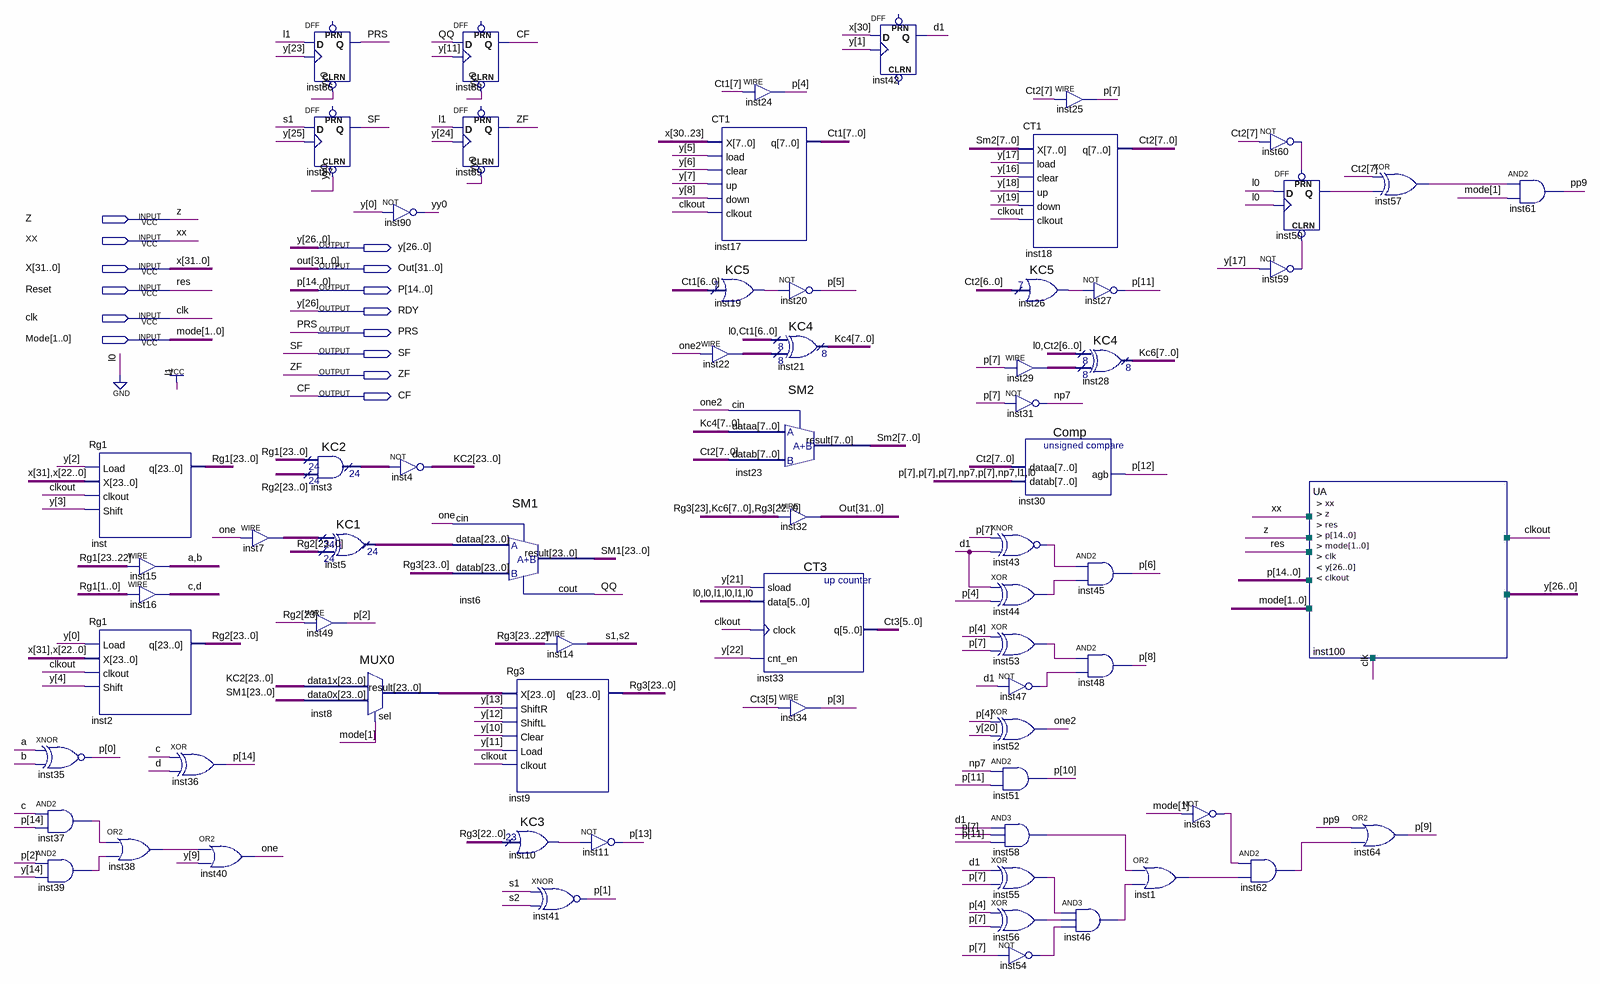
[diagram p0: schematic sheet]
// Quartus schematic lab.bdf as structural Verilog: 69 symbols, 14 pins
module lab (
  input  Z,
  input  XX,
  input  [31:0] X,
  input  Reset,
  input  clk,
  input  [1:0] Mode,
  output [26:0] y,
  output [31:0] Out,
  output [14:0] P,
  output RDY,
  output PRS,
  output SF,
  output ZF,
  output CF
);

  wire a, b, c, clkout, d, d1, inst1_out, inst10_result, inst19_result, inst26_result, inst37_out,
       inst38_out, inst39_out, inst43_out, inst44_out, inst46_out, inst47_out, inst50_q, inst53_out,
       inst54_out, inst55_out, inst56_out, inst57_out, inst58_out, inst59_out, inst60_out, inst62_out,
       inst63_out, np7, one, one2, pp9, QQ, s1, s2, yy0;
  wire [5:0] Ct3;
  wire [7:0] Ct1, Ct2, inst22_out, inst29_out, Kc4, Kc6, Sm2;
  wire [23:0] inst3_result, inst5_result, inst7_out, inst8_result, KC2, Rg1, Rg2, Rg3, SM1;

  xnor inst35 (P[0], a, b);
  and inst37 (inst37_out, c, P[14]);
  and inst39 (inst39_out, P[2], y[14]);
  Rg1 inst (.Load(y[2]), .X({X[31], X[22:0]}), .clkout(clkout), .Shift(y[3]), .q(Rg1));
  assign {a, b} = Rg1[23:22];  // WIRE inst15
  assign {c, d} = Rg1[1:0];  // WIRE inst16
  Rg1 inst2 (.Load(y[0]), .X({X[31], X[22:0]}), .clkout(clkout), .Shift(y[4]), .q(Rg2));
  or inst38 (inst38_out, inst37_out, inst39_out);
  xor inst36 (P[14], c, d);
  assign inst7_out = {24{one}};  // WIRE inst7
  or inst40 (one, inst38_out, y[9]);
  DFF inst86 (.CLRN(yy0), .CLK(y[23]), .D(1'b1), .Q(PRS));  // open: PRN
  DFF inst87 (.CLRN(yy0), .CLK(y[25]), .D(s1), .Q(SF));  // open: PRN
  KC2 inst3 (.data0x(Rg1), .data1x(Rg2), .result(inst3_result));
  KC1 inst5 (.data0x(inst7_out), .data1x(Rg2), .result(inst5_result));
  assign P[2] = Rg2[23];  // WIRE inst49
  MUX0 inst8 (.data1x(KC2), .data0x(SM1), .sel(Mode[1]), .result(inst8_result));
  not inst90 (yy0, y[0]);
  assign KC2 = ~inst3_result;  // NOT inst4, 24 bits wide
  DFF inst88 (.CLRN(yy0), .CLK(y[11]), .D(QQ), .Q(CF));  // open: PRN
  DFF inst89 (.CLRN(yy0), .CLK(y[24]), .D(1'b1), .Q(ZF));  // open: PRN
  SM1 inst6 (.dataa(inst5_result), .datab(Rg3), .cin(one), .result(SM1), .cout(QQ));
  Rg3 inst9 (.X(inst8_result), .ShiftR(y[13]), .ShiftL(y[12]), .Clear(y[10]), .Load(y[11]), .clkout(clkout), .q(Rg3));
  KC3 inst10 (.data(Rg3[22:0]), .result(inst10_result));
  assign {s1, s2} = Rg3[23:22];  // WIRE inst14
  not inst11 (P[13], inst10_result);
  xnor inst41 (P[1], s1, s2);
  assign P[4] = Ct1[7];  // WIRE inst24
  CT1 inst17 (.X(X[30:23]), .load(y[5]), .clear(y[6]), .up(y[7]), .down(y[8]), .clkout(clkout), .q(Ct1));
  KC5 inst19 (.data(Ct1[6:0]), .result(inst19_result));
  assign inst22_out = {8{one2}};  // WIRE inst22
  SM2 inst23 (.dataa(Kc4), .datab(Ct2), .cin(one2), .result(Sm2));
  CT3 inst33 (.sload(y[21]), .data(6'b001010), .clock(clkout), .cnt_en(y[22]), .q(Ct3));
  not inst20 (P[5], inst19_result);
  KC4 inst21 (.data0x({1'b0, Ct1[6:0]}), .data1x(inst22_out), .result(Kc4));
  assign Out = {Rg3[23], Kc6, Rg3[22:0]};  // WIRE inst32
  assign P[3] = Ct3[5];  // WIRE inst34
  DFF inst42 (.CLK(y[1]), .D(X[30]), .Q(d1));  // open: CLRN, PRN
  CT1 inst18 (.X(Sm2), .load(y[17]), .clear(y[16]), .up(y[18]), .down(y[19]), .clkout(clkout), .q(Ct2));
  KC5 inst26 (.data(Ct2[6:0]), .result(inst26_result));
  assign inst29_out = {8{P[7]}};  // WIRE inst29
  not inst31 (np7, P[7]);
  Comp inst30 (.dataa(Ct2), .datab({{3{P[7]}}, np7, P[7], np7, 2'b10}), .agb(P[12]));
  xnor inst43 (inst43_out, P[7], d1);
  xor inst44 (inst44_out, d1, P[4]);
  xor inst53 (inst53_out, P[4], P[7]);
  not inst47 (inst47_out, d1);
  xor inst52 (one2, P[4], y[20]);
  and inst51 (P[10], np7, P[11]);
  and inst58 (inst58_out, d1, P[7], P[11]);
  xor inst55 (inst55_out, d1, P[7]);
  xor inst56 (inst56_out, P[4], P[7]);
  not inst54 (inst54_out, P[7]);
  assign P[7] = Ct2[7];  // WIRE inst25
  not inst27 (P[11], inst26_result);
  KC4 inst28 (.data0x({1'b0, Ct2[6:0]}), .data1x(inst29_out), .result(Kc6));
  and inst45 (P[6], inst43_out, inst44_out);
  and inst48 (P[8], inst53_out, inst47_out);
  and inst46 (inst46_out, inst55_out, inst56_out, inst54_out);
  or inst1 (inst1_out, inst58_out, inst46_out);
  not inst63 (inst63_out, Mode[1]);
  not inst60 (inst60_out, Ct2[7]);
  not inst59 (inst59_out, y[17]);
  and inst62 (inst62_out, inst63_out, inst1_out);
  DFF inst50 (.CLRN(inst59_out), .CLK(1'b0), .D(1'b0), .PRN(inst60_out), .Q(inst50_q));
  UA inst100 (.xx(XX), .z(Z), .res(Reset), .p(P), .mode(Mode), .clk(clk), .y({RDY, y[25:0]}), .clkout(clkout));
  xor inst57 (inst57_out, Ct2[7], inst50_q);
  or inst64 (P[9], pp9, inst62_out);
  and inst61 (pp9, inst57_out, Mode[1]);

  assign y[26] = RDY;

  // Other names for the same wires on the sheet: res = Reset
endmodule
